# EAGLE design onepiece (EAGLE 5.07)
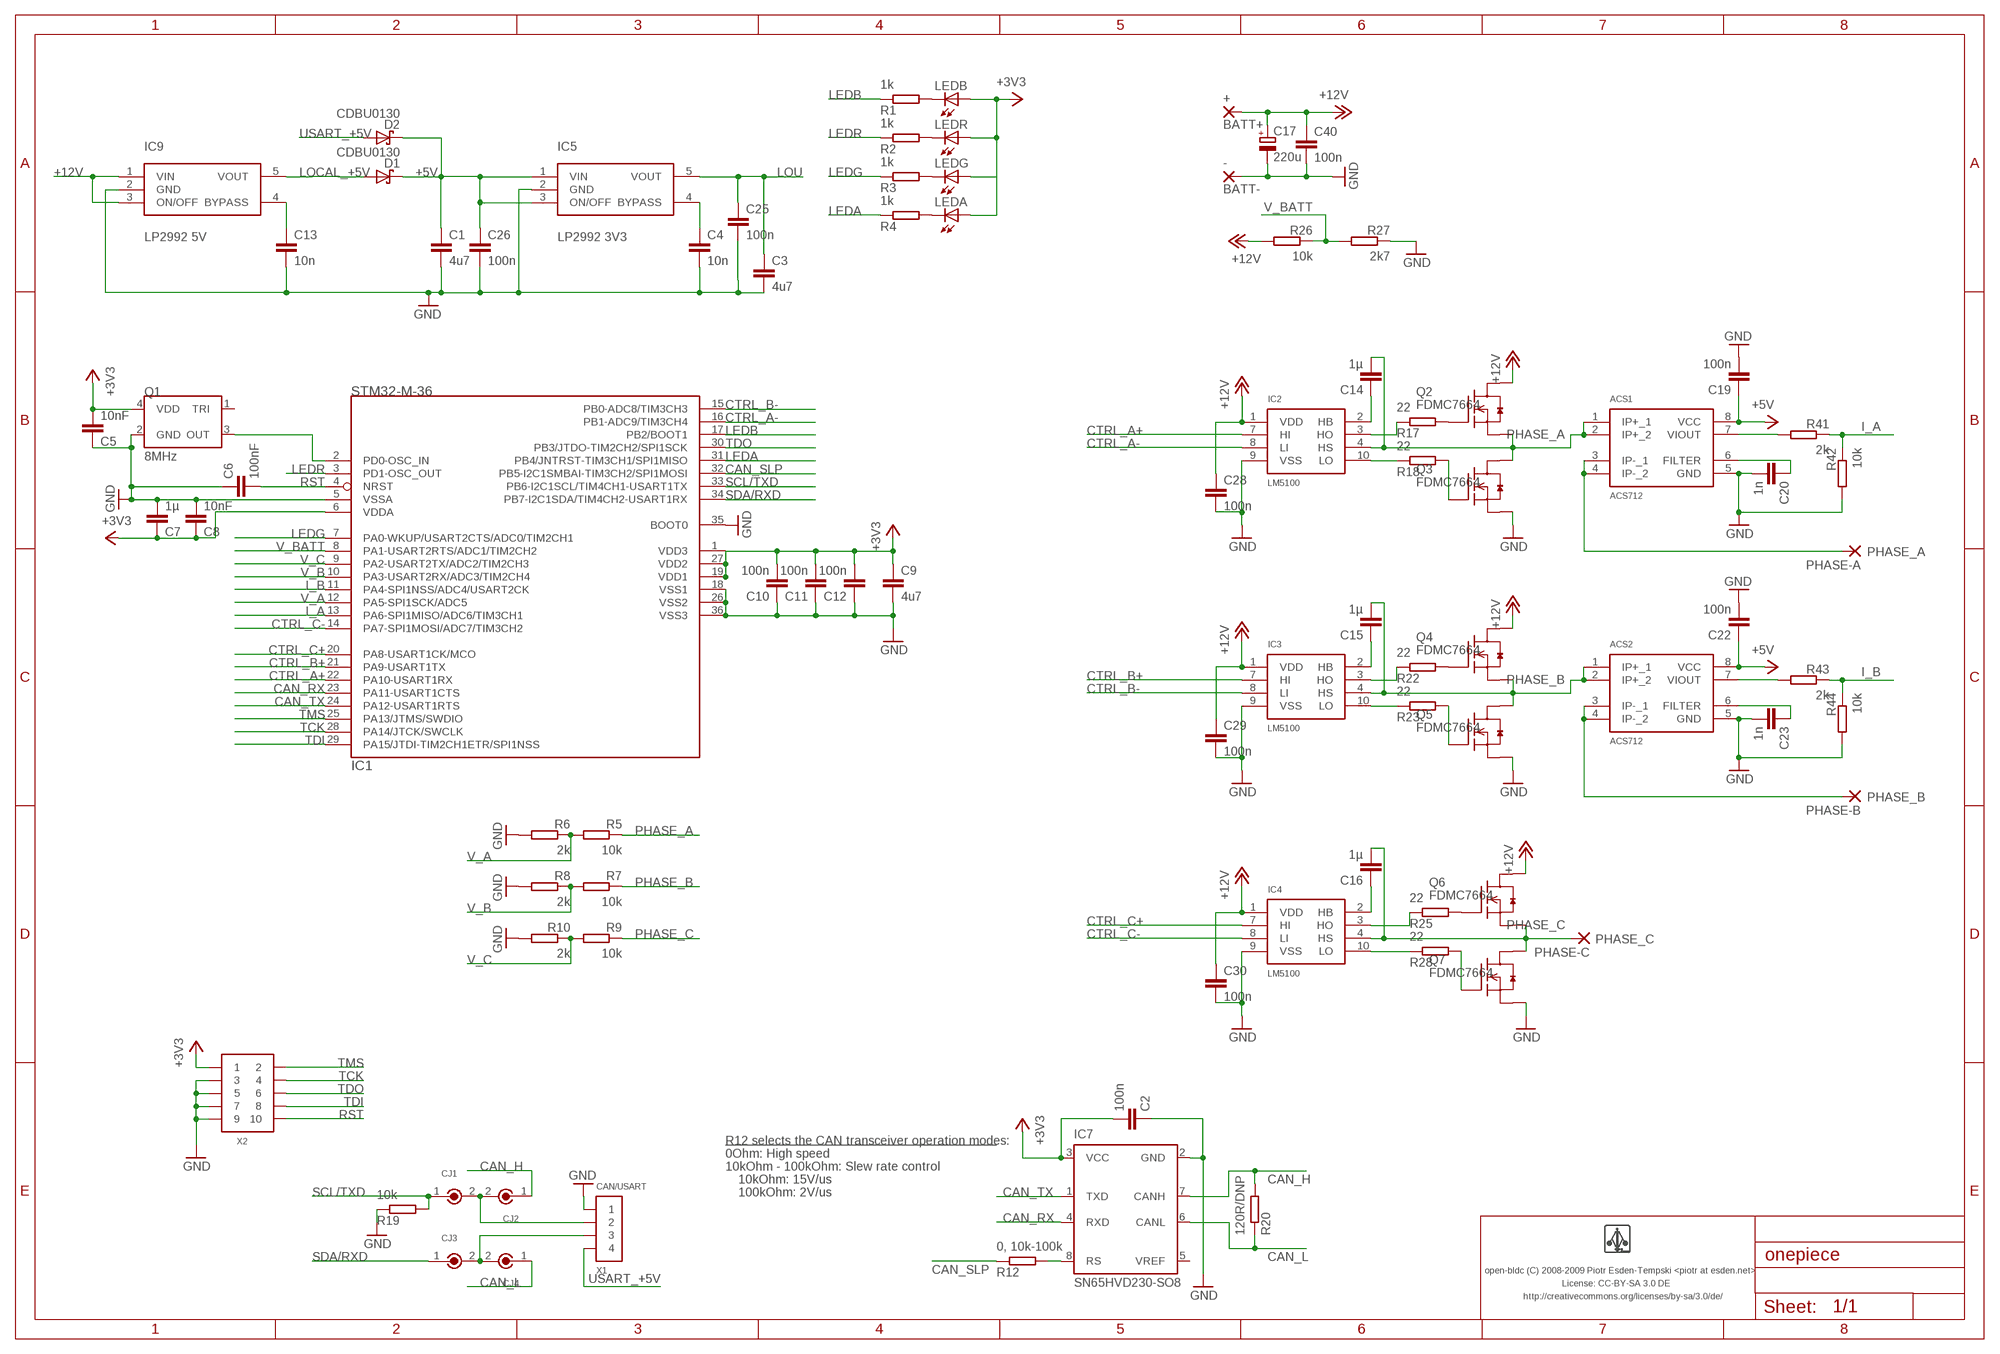
[diagram p0: schematic, sheet 1]

## Parts
+  BATT+  SMD5  [SMD2,54-5,08]
-  BATT-  SMD5  [SMD2,54-5,08]
ACS1  ACS712  [SO8]
ACS2  ACS712  [SO8]
C1  4u7  CAPACITOR-0603  [0603-CAP]
C2  100n  CAPACITOR-0603  [0603-CAP]
C3  4u7  CAPACITOR-0603  [0603-CAP]
C4  10n  CAPACITOR-0603  [0603-CAP]
C5  10nF  CAPACITOR-0603  [0603-CAP]
C6  100nF  CAPACITOR-0603  [0603-CAP]
C7  1µ  CAPACITOR-0603  [0603-CAP]
C8  10nF  CAPACITOR-0603  [0603-CAP]
C9  4u7  CAPACITOR-0603  [0603-CAP]
C10  100n  CAPACITOR-0603  [0603-CAP]
C11  100n  CAPACITOR-0603  [0603-CAP]
C12  100n  CAPACITOR-0603  [0603-CAP]
C13  10n  CAPACITOR-0603  [0603-CAP]
C14  1µ  CAPACITOR-0603  [0603-CAP]
C15  1µ  CAPACITOR-0603  [0603-CAP]
C16  1µ  CAPACITOR-0603  [0603-CAP]
C17  220u  CAPACITOR-POLD  [7343/D]
C19  100n  CAPACITOR-0603  [0603-CAP]
C20  1n  CAPACITOR-0603  [0603-CAP]
C22  100n  CAPACITOR-0603  [0603-CAP]
C23  1n  CAPACITOR-0603  [0603-CAP]
C25  100n  CAPACITOR-0603  [0603-CAP]
C26  100n  CAPACITOR-0603  [0603-CAP]
C28  100n  CAPACITOR-0603  [0603-CAP]
C29  100n  CAPACITOR-0603  [0603-CAP]
C30  100n  CAPACITOR-0603  [0603-CAP]
C40  100n  CAPACITOR-0603  [0603-CAP]
CJ1  CIRC_JMP  [CIRC_JMP]
CJ2  CIRC_JMP  [CIRC_JMP]
CJ3  CIRC_JMP  [CIRC_JMP]
CJ4  CIRC_JMP  [CIRC_JMP]
D1  CDBU0130  [0603-LED]
D2  CDBU0130  [0603-LED]
IC1  STM32-M-36  [VFQFPN36-LP]
IC2  LM5100  [LLP-10]
IC3  LM5100  [LLP-10]
IC4  LM5100  [LLP-10]
IC5  LP2992 3V3  LP2992  [SOT23-5]
IC7  SN65HVD230-SO8  SN65HVD230  [SO8]
IC9  LP2992 5V  LP2992  [SOT23-5]
LEDA  AMBER  LED  [0603-LED]
LEDB  BLUE  LED  [0603-LED]
LEDG  GREEN  LED  [0603-LED]
LEDR  RED  LED  [0603-LED]
PHASE-A  PHASE_A  SMD5  [SMD2,54-5,08]
PHASE-B  PHASE_B  SMD5  [SMD2,54-5,08]
PHASE-C  PHASE_C  SMD5  [SMD2,54-5,08]
Q1  8MHz  ASE_ASCILLATOR  [ASE_OSCILLATOR]
Q2  FDMC7664  [MLP33]
Q3  FDMC7664  [MLP33]
Q4  FDMC7664  [MLP33]
Q5  FDMC7664  [MLP33]
Q6  FDMC7664  [MLP33]
Q7  FDMC7664  [MLP33]
R1  1k  RESISTOR-0603  [0603-RES]
R2  1k  RESISTOR-0603  [0603-RES]
R3  1k  RESISTOR-0603  [0603-RES]
R4  1k  RESISTOR-0603  [0603-RES]
R5  10k  RESISTOR-0603  [0603-RES]
R6  2k  RESISTOR-0603  [0603-RES]
R7  10k  RESISTOR-0603  [0603-RES]
R8  2k  RESISTOR-0603  [0603-RES]
R9  10k  RESISTOR-0603  [0603-RES]
R10  2k  RESISTOR-0603  [0603-RES]
R12  0, 10k-100k  RESISTOR-0603  [0603-RES]
R17  22  RESISTOR-0603  [0603-RES]
R18  22  RESISTOR-0603  [0603-RES]
R19  10k  RESISTOR-0603  [0603-RES]
R20  120R/DNP  RESISTOR-0603  [0603-RES]
R22  22  RESISTOR-0603  [0603-RES]
R23  22  RESISTOR-0603  [0603-RES]
R25  22  RESISTOR-0603  [0603-RES]
R26  10k  RESISTOR-0603  [0603-RES]
R27  2k7  RESISTOR-0603  [0603-RES]
R28  22  RESISTOR-0603  [0603-RES]
R41  2k  RESISTOR-0603  [0603-RES]
R42  10k  RESISTOR-0603  [0603-RES]
R43  2k  RESISTOR-0603  [0603-RES]
R44  10k  RESISTOR-0603  [0603-RES]
U$1  LOGO  LOGO-SMALL  [LOGO_SMALL]
X1  CAN/USART  CONN_4-1-53261  [PB-53261-04]
X2  PIN_HDR_EDG_1.27MM_5-2  PIN_HDR_EDG_1.27MM_5-2-DH  [PIN_HDR_1.27MM_SMD_DH_10]

## Nets
+5V: ACS1.8(VCC) ACS2.8(VCC) C1.P$1 C19.P$1 C22.P$1 C26.P$1 D1.C D2.C IC5.1(VIN) IC5.3(ON/OFF)
+12V: +.1(P) C17.+ C28.P$1 C29.P$1 C30.P$1 C40.P$1 IC2.1(VDD) IC3.1(VDD) IC4.1(VDD) IC9.1(VIN) IC9.3(ON/OFF) Q2.5678D(D) Q4.5678D(D) Q6.5678D(D) R26.P$2
CAN_H: CJ2.1 IC7.7(CANH) R20.P$2
CAN_L: CJ4.1 IC7.6(CANL) R20.P$1
CAN_RX: IC1.23(PA11-USART1CTS) IC7.4(RXD)
CAN_SLP: IC1.32(PB5-I2C1SMBAI-TIM3CH2/SPI1MOSI) R12.P$1
CAN_TX: IC1.24(PA12-USART1RTS) IC7.1(TXD)
CTRL_A+: IC1.22(PA10-USART1RX) IC2.7(HI)
CTRL_A-: IC1.16(PB1-ADC9/TIM3CH4) IC2.8(LI)
CTRL_B+: IC1.21(PA9-USART1TX) IC3.7(HI)
CTRL_B-: IC1.15(PB0-ADC8/TIM3CH3) IC3.8(LI)
CTRL_C+: IC1.20(PA8-USART1CK/MCO) IC4.7(HI)
CTRL_C-: IC1.14(PA7-SPI1MOSI/ADC7/TIM3CH2) IC4.8(LI)
GND: -.1(P) ACS1.5(GND) ACS2.5(GND) C1.P$2 C2.P$1 C3.P$2 C4.P$2 C5.P$1 C6.P$1 C7.P$2 C8.P$2 C9.P$2 C10.P$1 C11.P$1 C12.P$1 C13.P$2 C17.- C19.P$2 C20.P$2 C22.P$2 C23.P$2 C25.P$2 C26.P$2 C28.P$2 C29.P$2 C30.P$2 C40.P$2 IC1.5(VSSA) IC1.18(VSS1) IC1.26(VSS2) IC1.35(BOOT0) IC1.36(VSS3) IC2.9(VSS) IC3.9(VSS) IC4.9(VSS) IC5.2(GND) IC7.2(GND) IC9.2(GND) Q1.2(GND) Q3.123S(S) Q5.123S(S) Q7.123S(S) R6.P$2 R8.P$2 R10.P$2 R19.P$1 R27.P$1 R42.P$2 R44.P$2 X1.1 X2.3 X2.5 X2.7 X2.9
I_A: IC1.13(PA6-SPI1MISO/ADC6/TIM3CH1) R41.P$1 R42.P$1
I_B: IC1.11(PA4-SPI1NSS/ADC4/USART2CK) R43.P$1 R44.P$1
I_PHASE_A: ACS1.3(IP-_1) ACS1.4(IP-_2) PHASE-A.1(P)
I_PHASE_B: ACS2.3(IP-_1) ACS2.4(IP-_2) PHASE-B.1(P)
LEDA: IC1.31(PB4/JNTRST-TIM3CH1/SPI1MISO) R4.P$1
LEDB: IC1.17(PB2/BOOT1) R1.P$1
LEDG: IC1.7(PA0-WKUP/USART2CTS/ADC0/TIM2CH1) R3.P$1
LEDR: IC1.3(PD1-OSC_OUT) R2.P$1
LOCAL_+5V: D1.A IC9.5(VOUT)
LOU: C2.P$2 C3.P$1 C5.P$2 C7.P$1 C8.P$1 C9.P$1 C10.P$2 C11.P$2 C12.P$2 C25.P$1 IC1.1(VDD3) IC1.6(VDDA) IC1.19(VDD1) IC1.27(VDD2) IC5.5(VOUT) IC7.3(VCC) LEDA.A LEDB.A LEDG.A LEDR.A Q1.4(VDD) X2.1 ; supply symbol labelled +3V3
N$1: IC3.3(HO) R22.P$1
N$2: IC2.3(HO) R17.P$1
N$3: LEDB.C R1.P$2
N$4: C4.P$1 IC5.4(BYPASS)
N$5: LEDG.C R3.P$2
N$6: C13.P$1 IC9.4(BYPASS)
N$7: IC2.10(LO) R18.P$1
N$8: IC7.8(RS) R12.P$2
N$9: CJ3.2 CJ4.2 X1.3
N$10: LEDR.C R2.P$2
N$11: Q2.4G(G) R17.P$2
N$12: C14.P$1 IC2.2(HB)
N$13: IC3.10(LO) R23.P$1
N$14: Q4.4G(G) R22.P$2
N$15: Q6.4G(G) R25.P$2
N$16: C15.P$1 IC3.2(HB)
N$17: Q5.4G(G) R23.P$2
N$18: IC4.3(HO) R25.P$1
N$19: IC4.10(LO) R28.P$1
N$21: C16.P$1 IC4.2(HB)
N$22: LEDA.C R4.P$2
N$23: CJ1.2 CJ2.2 X1.2
N$28: Q7.4G(G) R28.P$2
N$31: ACS1.6(FILTER) C20.P$1
N$32: ACS1.7(VIOUT) R41.P$2
N$34: ACS2.6(FILTER) C23.P$1
N$35: ACS2.7(VIOUT) R43.P$2
N$40: IC1.2(PD0-OSC_IN) Q1.3(OUT)
N$43: Q3.4G(G) R18.P$2
PHASE_A: ACS1.1(IP+_1) ACS1.2(IP+_2) C14.P$2 IC2.4(HS) Q2.123S(S) Q3.5678D(D) R5.P$1
PHASE_B: ACS2.1(IP+_1) ACS2.2(IP+_2) C15.P$2 IC3.4(HS) Q4.123S(S) Q5.5678D(D) R7.P$1
PHASE_C: C16.P$2 IC4.4(HS) PHASE-C.1(P) Q6.123S(S) Q7.5678D(D) R9.P$1
RST: C6.P$2 IC1.4(NRST) X2.10
SCL/TXD: CJ1.1 IC1.33(PB6-I2C1SCL/TIM4CH1-USART1TX) R19.P$2
SDA/RXD: CJ3.1 IC1.34(PB7-I2C1SDA/TIM4CH2-USART1RX)
TCK: IC1.28(PA14/JTCK/SWCLK) X2.4
TDI: IC1.29(PA15/JTDI-TIM2CH1ETR/SPI1NSS) X2.8
TDO: IC1.30(PB3/JTDO-TIM2CH2/SPI1SCK) X2.6
TMS: IC1.25(PA13/JTMS/SWDIO) X2.2
USART_+5V: D2.A X1.4
V_A: IC1.12(PA5-SPI1SCK/ADC5) R5.P$2 R6.P$1
V_B: IC1.10(PA3-USART2RX/ADC3/TIM2CH4) R7.P$2 R8.P$1
V_BATT: IC1.8(PA1-USART2RTS/ADC1/TIM2CH2) R26.P$1 R27.P$2
V_C: IC1.9(PA2-USART2TX/ADC2/TIM2CH3) R9.P$2 R10.P$1
Unconnected: IC7.5(VREF) Q1.1(TRI)

## Notes on the sheet
- R12 selects the CAN transceiver operation modes:
- 0Ohm: High speed
- 10kOhm - 100kOhm: Slew rate control
- 10kOhm: 15V/us
- 100kOhm: 2V/us
- open-bldc (C) 2008-2009 Piotr Esden-Tempski <piotr at esden.net>
- License: CC-BY-SA 3.0 DE
- http://creativecommons.org/licenses/by-sa/3.0/de/

## Library data of the parts
+ - PHASE-A PHASE-B PHASE-C = wirepad:SMD5: SMD PAD
ACS1 ACS2 = open-bldc:ACS712
C1-C16 C19 C20 C22 C23 C25 C26 C28-C30 C40 = pel_dipol_comp:CAPACITOR
C17 = res_cap:CAPACITOR-POL
CJ1-CJ4 = pel_jumpers:CIRC_JMP
D1 D2 = open-bldc:CDBU0130
IC1 = pel_stm32:STM32-M-36: STM32F103 Medium Density 36 Pins
IC2-IC4 = open-bldc:LM5100
IC5 IC9 = open-bldc:LP2992
IC7 = open-bldc:SN65HVD230: SN65HVD230 - 3.3V CAN Transceiver - 3.3V operation - ISO 11898 compliant - up to 1Mbps - up to 120 nodes - listen only mode - slope control
LEDA LEDB LEDG LEDR = open-bldc:LED
Q1 = open-bldc:ASE_ASCILLATOR
Q2-Q7 = open-bldc:FDMC7664
R1-R10 R12 R17-R20 R22 R23 R25-R28 R41-R44 = pel_dipol_comp:RESISTOR
U$1 = open-bldc:LOGO
X1 = pel_molex:CONN_4-1
X2 = open-bldc:PIN_HDR_EDG_1.27MM_5-2

## Board
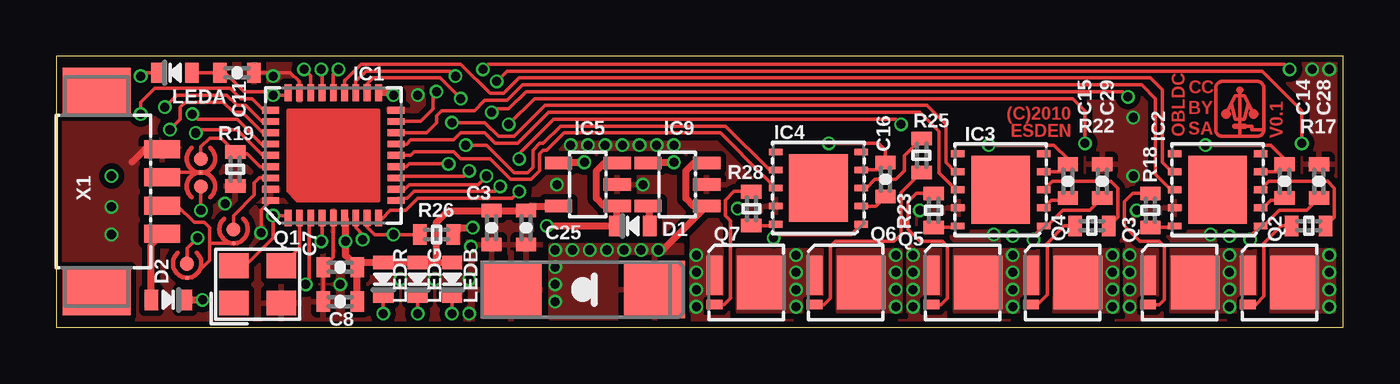
[diagram p1: board, top side]
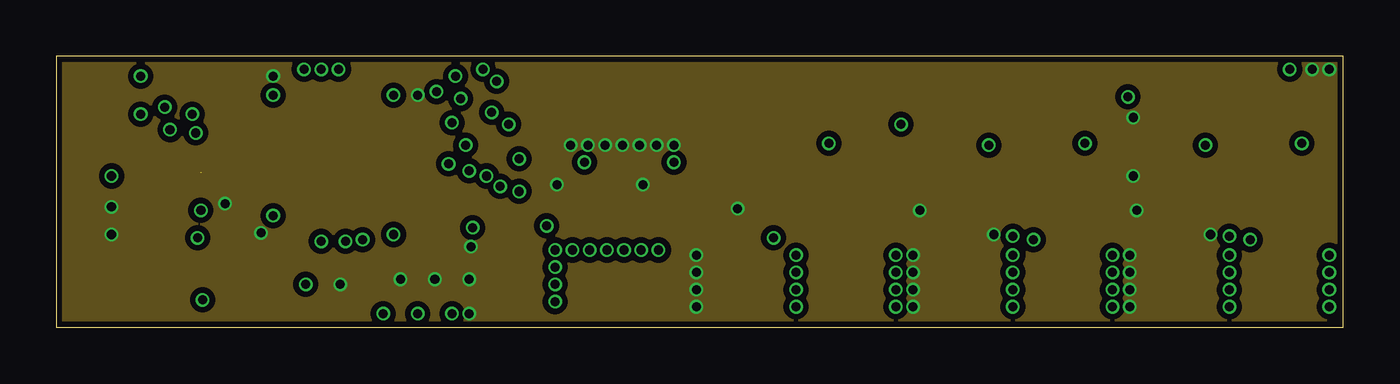
[diagram p2: board, inner layer Route2]
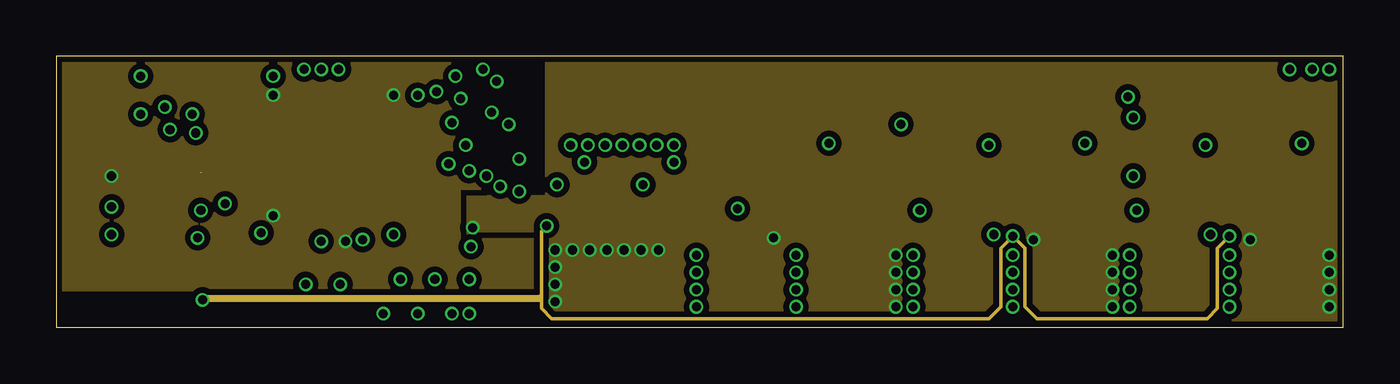
[diagram p3: board, inner layer Route15]
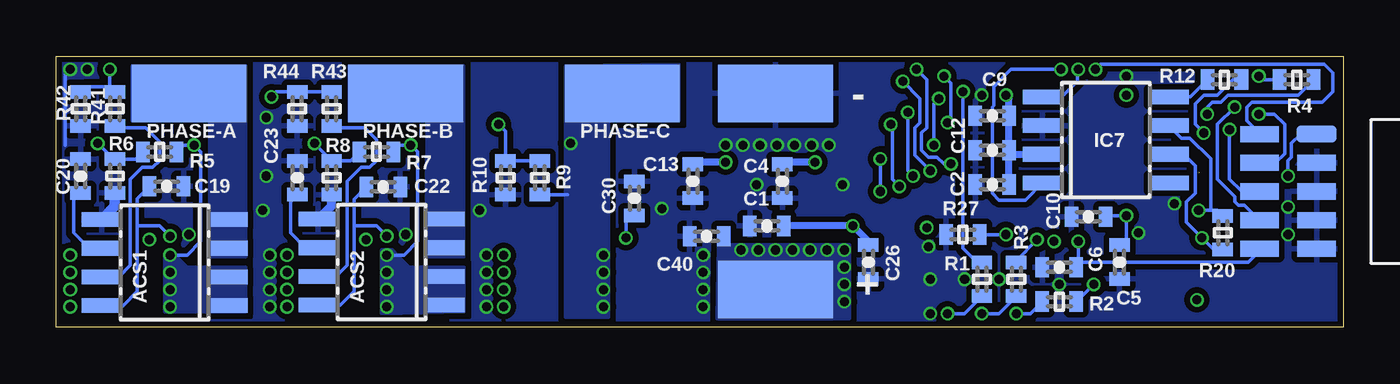
[diagram p4: board, bottom side, seen from below]

Size 57 x 12 mm. Coordinates in mm from the lower left corner, seen from the top.
Outline: 0,0 57,0 57,12 0,12 0,0
Copper layers (1*2+15*16): Top 0.035mm / dielectric 1.5mm / Route2 0.035mm / dielectric 0.15mm / Route15 0.035mm / dielectric 0.2mm / Bottom 0.035mm
Design rules "default *": minimum track width 6mil, minimum drill 0.4mm, track to track 6mil, track to pad 6mil, pad to pad 6mil, via to via 6mil, smd to smd 6mil, copper to edge 10mil, drill to drill 6mil, minimum pad ring 0.1mm, minimum via ring 0.1mm, stop-mask expansion 4mil, vias tented up to drill 0.4mm, thermal gap 10mil

### Footprints (pad centres in the part's own frame; a part is rotated, then mirrored left to right if it is on the bottom)
SMD2,54-5,08 = smd 2.54 x 5.08: 1 0,0
SO8 = smd 0.65 x 1.75: 1 -1.905,-2.8; 2 -0.635,-2.8; 3 0.635,-2.8; 4 1.905,-2.8; 5 1.905,2.8; 6 0.635,2.8; 7 -0.635,2.8; 8 -1.905,2.8
0603-CAP = smd 0.6 x 0.9: P$1 -0.75,0; P$2 0.75,0
7343/D = smd 2.7 x 2.55: + -3.175,0; - 3.175,0
CIRC_JMP = smd 0.61 x 0.61: 1 0,0 | smd 0.203 x 0.203: 2 0,0.617
0603-LED = smd 0.6 x 0.9: A 0.75,0; C -0.75,0
VFQFPN36-LP = smd 0.75 x 0.3: 1 -2.775,2; 2 -2.775,1.5; 3 -2.775,1; 4 -2.775,0.5; 5 -2.775,0; 6 -2.775,-0.5; 7 -2.775,-1; 8 -2.775,-1.5; 9 -2.775,-2; 19 2.775,-2; 20 2.775,-1.5; 21 2.775,-1; 22 2.775,-0.5; 23 2.775,0; 24 2.775,0.5; 25 2.775,1; 26 2.775,1.5; 27 2.775,2 | smd 0.3 x 0.75: 10 -2,-2.775; 11 -1.5,-2.775; 12 -1,-2.775; 13 -0.5,-2.775; 14 0,-2.775; 15 0.5,-2.775; 16 1,-2.775; 17 1.5,-2.775; 18 2,-2.775; 28 2,2.775; 29 1.5,2.775; 30 1,2.775; 31 0.5,2.775; 32 0,2.775; 33 -0.5,2.775; 34 -1,2.775; 35 -1.5,2.775; 36 -2,2.775
LLP-10 = smd 0.3 x 0.6: 1 1.6,1.9; 2 0.8,1.9; 3 0,1.9; 4 -0.8,1.9; 5 -1.6,1.9; 6 -1.6,-1.9; 7 -0.8,-1.9; 8 0,-1.9; 9 0.8,-1.9; 10 1.6,-1.9 | smd 3 x 2.6: PAD 0,0
SOT23-5 = smd 0.55 x 1.2: 1 -0.95,-1.3; 2 0,-1.3; 3 0.95,-1.3; 4 0.95,1.3; 5 -0.95,1.3
ASE_OSCILLATOR = smd 1.3 x 1.1: 1 -1.05,-0.825; 2 1.05,-0.825; 3 1.05,0.825; 4 -1.05,0.825
MLP33 = smd 0.42 x 0.7: 4G 0.975,-1.4 | smd 1.72 x 0.7: 123S -0.325,-1.4 | smd 2.37 x 2.15: 5678D 0,0.675
0603-RES = smd 0.6 x 0.9: P$1 -0.75,0; P$2 0.75,0
PB-53261-04 = smd 0.8 x 1.6: 1 -1.875,1.1; 2 -0.625,1.1; 3 0.625,1.1; 4 1.875,1.1 | smd 2.1 x 3: MNT1 -4.425,-1.8; MNT2 4.425,-1.8
PIN_HDR_1.27MM_SMD_DH_10 = smd 1.78 x 0.76: 1 -1.27,-2.54 | smd 1.702 x 0.711: 2 1.27,-2.54; 3 -1.27,-1.27; 4 1.27,-1.27; 5 -1.27,0; 6 1.27,0; 7 -1.27,1.27; 8 1.27,1.27; 9 -1.27,2.54; 10 1.27,2.54

### Placement (x,y rotation side)
+  25.15,1.68 270 bottom
-  25.15,10.36 270 bottom
ACS1  52.2,2.87 90 bottom
ACS2  42.6,2.9 90 bottom
C1  25.53,4.5 180 bottom
C2  15.54,6.32 0 bottom
C3  19.28,4.42 270 top
C4  24.84,6.48 270 bottom
C5  9.91,2.9 90 bottom
C6  12.57,2.67 0 bottom
C7  12.57,2.67 180 top
C8  12.57,1.14 180 top
C9  15.54,9.37 180 bottom
C10  11.28,4.9 0 bottom
C11  8,11.28 180 top
C12  15.54,7.85 0 bottom
C13  28.8,6.48 270 bottom
C14  54.41,6.48 90 top
C15  44.81,6.48 90 top
C16  36.73,6.55 90 top
C17  23.32,1.68 180 top
C19  52.12,6.25 0 bottom
C20  55.93,6.71 90 bottom
C22  42.52,6.22 0 bottom
C23  46.33,6.63 90 bottom
C25  20.8,4.42 270 top
C26  21.03,2.9 270 bottom
C28  55.93,6.48 90 top
C29  46.33,6.48 90 top
C30  31.39,5.71 90 bottom
C40  28.19,4.04 180 bottom
CJ1  6.4,7.47 180 top
CJ2  6.4,6.25 0 top
CJ3  7.85,4.34 180 top
CJ4  5.79,2.82 180 top
D1  25.53,4.5 0 top
D2  4.95,1.22 180 top
IC1  12.27,7.62 90 top
IC2  51.44,6.1 270 top
IC3  41.83,6.1 270 top
IC4  33.76,6.17 270 top
IC5  23.55,6.32 90 top
IC7  10.52,8.31 270 bottom
IC9  27.51,6.32 90 top
LEDA  5.26,11.28 0 top
LEDB  17.53,2.13 90 top
LEDG  16,2.13 90 top
LEDR  14.48,2.13 90 top
PHASE-A  51.13,10.36 90 bottom
PHASE-B  41.53,10.36 90 bottom
PHASE-C  31.93,10.36 90 bottom
Q1  8.92,1.91 0 top
Q2  54.18,1.98 270 top
Q3  49.76,1.98 270 top
Q4  44.58,1.98 270 top
Q5  40.16,1.98 270 top
Q6  34.98,1.98 270 top
Q7  30.56,1.98 270 top
R1  16,2.13 270 bottom
R2  12.57,1.14 180 bottom
R3  14.48,2.13 270 bottom
R4  2.06,10.97 180 bottom
R5  52.43,7.77 180 bottom
R6  54.41,6.7 270 bottom
R7  42.82,7.77 180 bottom
R8  44.81,6.63 270 bottom
R9  35.59,6.63 90 bottom
R10  37.11,6.63 270 bottom
R12  5.26,10.97 180 bottom
R17  55.47,4.5 180 top
R18  48.46,5.18 90 top
R19  7.92,7.01 90 top
R20  5.33,4.19 90 bottom
R22  45.87,4.5 180 top
R23  38.86,5.18 90 top
R25  38.33,7.62 270 top
R26  16.84,4.11 0 top
R27  16.84,4.11 0 bottom
R28  30.78,5.26 90 top
R41  54.41,9.68 270 bottom
R42  55.93,9.68 270 bottom
R43  44.81,9.68 270 bottom
R44  46.33,9.68 270 bottom
U$1  52.43,9.83 0 top
X1  3.58,6.02 270 top
X2  2.44,6.02 180 bottom

### Tracks (layer width: path | path; a pad name or v marks a point on that pad's centre or on a via)
+5V  (via drill 0.4)
  Top 0.305: IC5.3 24.27,7.28 23.93,6.93 23.93,5.71 24.27,5.38 IC5.1 24.85,4.57 C1.P$1 v21.72,4.5 | D2.C v6.48,1.22
  Route15 0.152: v51.97,4.04 51.44,3.5 51.44,0.84 50.98,0.38 43.43,0.38 42.9,0.91 42.9,3.5 v42.37,4.04 41.83,3.5 41.83,0.91 41.3,0.38 21.95,0.38 21.49,0.84 | 21.49,1.29 21.49,0.84 | 21.41,1.29 21.49,1.29 | 21.49,1.29 21.49,0.84 | 21.49,1.29 21.49,4.27 v21.72,4.5
  Route15 0.305: v6.48,1.22 6.55,1.29 21.41,1.29
  Bottom 0.152: C19.P$1 53.42,5.7 53.42,4.5 | 53.42,4.5 53.42,1.6 54.05,0.96 ACS1.8 | v51.97,4.04 52.43,4.5 53.42,4.5 | ACS2.8 44.42,0.99 43.81,1.6 43.81,4.5 | 43.81,4.5 43.81,5.68 C22.P$1 | v42.37,4.04 42.82,4.5 43.81,4.5
  Bottom 0.305: C1.P$1 v21.72,4.5 21.03,3.81 C26.P$1
+12V  (via drill 0.4)
  Top 0.152: C28.P$1 55.38,5.18 54.18,5.18 53.49,4.5 IC2.1 52.88,4.04 v52.88,3.89 | C29.P$1 45.78,5.18 44.58,5.18 43.89,4.5 IC3.1 43.28,4.04 v43.28,3.89 | IC4.1 35.2,4.12 32.54,4.12 31.93,4.12 v31.77,3.96
  Top 0.305: v26.67,3.43 26.86,3.43 IC9.1 28.23,5.38 27.89,5.71 27.89,6.93 28.23,7.28 IC9.3 | R26.P$2 17.89,4.42 v18.44,4.42
  Bottom 0.152: C30.P$1 31.77,4.96 v31.77,3.96
  other vias: 37.19,0.91 37.19,1.68 37.19,2.44 37.19,3.2 46.79,0.91 46.79,1.68 46.79,2.44 46.79,3.2 56.39,0.91 56.39,1.68 56.39,2.44 56.39,3.2 25.91,3.43 25.15,3.43 24.38,3.43 23.62,3.43 22.86,3.43 22.1,3.43 22.1,2.67 22.1,1.91 22.1,1.14
  pour Top (no thermals): 37.41,0.69 34.59,0.69 34.59,3.43 37.41,3.43
  pour Top (no thermals): 47.02,0.69 44.2,0.69 44.2,3.43 47.02,3.43
  pour Top (no thermals): 56.62,0.69 53.8,0.69 53.8,3.43 56.62,3.43
  pour Route15 (isolate 0.254, rank 6): 21.79,0 57.15,0 57.15,11.99 21.72,11.99 21.72,5.79 18.21,5.79 18.21,4.11 21.79,4.11
  pour Bottom (no thermals): 27.74,0.38 27.66,3.66 21.87,3.66 21.87,0.38
  pour Top: 27.81,0.38 27.74,3.66 21.87,3.66 21.87,0.38
CAN_H  (via drill 0.4)
  Top 0.152: v6.4,5.18 CJ2.1
  Bottom 0.152: IC7.7 7.16,8.38 6.78,8.38 5.87,7.47 5.87,5.18 | 5.88,5.18 5.87,5.18 | 5.88,5.18 5.87,5.18 | 5.88,5.18 v6.4,5.18 | 5.88,5.18 5.58,5.18 R20.P$2
CAN_L  (via drill 0.4)
  Top 0.152: CJ4.1 5.79,3.5 v6.25,3.96
  Bottom 0.152: IC7.6 7.06,7.67 6.55,7.16 6.55,5.94 6.93,5.56 6.93,4.65 v6.25,3.96 5.73,3.44 R20.P$1
CAN_RX  (via drill 0.4)
  Top 0.152: IC1.23 12.27,11.2 v12.5,11.43
  Bottom 0.152: IC7.4 14.08,5.64 15.24,5.64 15.54,5.94 15.54,9.75 15.47,9.83 15.47,10.67 14.71,11.43 v12.5,11.43
CAN_SLP  (via drill 0.4)
  Top 0.152: IC1.32 9.14,7.62 8,8.76 6.33,8.76 v6.17,8.61
  Bottom 0.152: 4.66,10.97 R12.P$1 4.88,10.97 5.56,10.29 6.17,10.29 6.55,9.91 6.55,8.99 v6.17,8.61
CAN_TX  (via drill 0.4)
  Top 0.152: IC1.24 11.77,11.4 v11.73,11.43
  Bottom 0.152: IC7.1 12.45,10.21 11.77,10.9 11.77,11.4 v11.73,11.43
CTRL_A+
  Top 0.152: IC2.7 49.42,6.9 49,7.32 49,10.52 48.46,11.05 20.5,11.05 19.81,10.36 19.2,10.36 17.91,11.66 17.75,11.66 13.49,11.66 12.8,10.97 12.77,10.94 IC1.22
CTRL_A-
  Top 0.152: IC2.8 49.38,6.1 48.69,6.78 48.69,10.13 48.08,10.74 20.65,10.74 19.96,10.06 18.97,10.06 18.52,9.6 17.07,9.6 16.84,9.37 16.84,9.07 16.39,8.62 IC1.16
CTRL_B+  (via drill 0.4)
  Top 0.152: IC3.7 39.81,6.9 39.4,7.32 39.4,8.99 38.56,9.83 21.64,9.83 20.27,8.46 19.58,8.46 18.97,9.07 v17.53,9.07 | v17.68,11.12 17.45,11.35 13.72,11.35 13.26,10.9 13.26,10.4 IC1.21
  Bottom 0.152: v17.68,11.12 17.37,10.82 17.37,9.22 v17.53,9.07
CTRL_B-
  Top 0.152: IC3.8 39.85,6.1 39.09,6.86 39.09,8.69 38.25,9.53 21.79,9.53 20.42,8.15 19.43,8.15 18.97,8.61 17.91,8.61 17.6,8.31 15.7,8.31 15.51,8.12 IC1.15
CTRL_C+  (via drill 0.4)
  Top 0.152: v17.91,10.13 17.68,10.36 16.99,11.05 14.02,11.05 13.77,10.8 IC1.20 | v18.14,8.08 19.05,8.08 20.27,6.86 20.88,6.86 21.11,7.09 21.11,7.85 21.41,8.15 21.57,8.15 22.33,8.91 29.64,8.91 31.59,6.97 IC4.7
  Bottom 0.152: v17.91,10.13 18.14,9.91 v18.14,8.08
CTRL_C-
  Top 0.152: 31.77,6.17 IC4.8 31.32,6.71 29.41,8.61 22.48,8.61 21.72,7.85 21.57,7.85 21.41,7.7 21.41,6.93 21.03,6.55 20.12,6.55 19.2,7.47 17.91,7.47 17.6,7.77 15.85,7.77 15.7,7.62 IC1.14
GND  (via drill 0.4)
  Top 0.152: C28.P$2 56.15,7.23 | C8.P$2 C7.P$2 12.27,3.11 IC1.5 | C11.P$1 10.36,11.28 10.74,10.9 10.74,10.42 IC1.26 | IC1.36 9.07,5.2 v9.07,4.19
  Top 0.305: 3.35,7.32 3.93,7.89
  Bottom 0.152: C20.P$2 55.99,7.46 | 56.62,8.08 56.62,11.2
  Bottom 0.406: R8.P$2 44.81,5.39 ACS2.5
  Bottom 0.457: R6.P$2 54.41,5.36 ACS1.5
  other vias: 28.35,0.91 28.35,1.68 28.35,2.44 28.35,3.2 37.95,0.91 37.95,1.68 37.95,2.44 37.95,3.2 47.55,0.91 47.55,1.68 47.55,2.44 47.55,3.2 55.63,11.43 56.39,11.43 51.13,4.11 47.85,5.18 38.25,5.18 41.53,4.11 47.7,9.3 47.7,6.71 30.18,5.26 16,10.29 12.57,1.91 22.78,8.08 23.55,8.08 24.31,8.08 25.07,8.08 25.83,8.08 26.59,8.08 27.36,8.08 25.98,6.32 22.17,6.32 2.44,5.33 2.44,4.11 9.6,11.13 7.47,5.49 18.29,0.61 18.29,2.13 18.36,3.58 16.76,2.13 15.24,2.13
  pour Top (no thermals): 28.12,3.43 29.49,3.43 29.49,0.69 28.12,0.69
  pour Top (no thermals): 37.72,0.69 39.24,0.69 39.24,3.43 37.72,3.43
  pour Top (no thermals): 47.35,0.69 48.77,0.69 48.77,3.43 47.32,3.43
  pour Bottom (isolate 0.254, rank 6): 0,0 57.15,0 57.15,11.99 0,11.99
  pour Route2 (isolate 0.254, rank 6): 0,0 57.15,0 57.15,11.99 0,11.99
  pour Top (isolate 0.254, rank 6): 0,0 57.15,0 57.15,11.99 0,11.99
  pour Bottom (no thermals): 28.65,3.51 28.12,3.51 28.12,0.23 28.65,0.23
I_A  (via drill 0.4)
  Top 0.152: v54.63,11.43 54.41,11.66 19.13,11.66 v18.9,11.43 | v17.37,7.24 15.62,7.24 15.54,7.16 15.5,7.12 IC1.13
  Bottom 0.152: R42.P$1 55.69,10.67 55.24,10.67 54.65,10.67 R41.P$1 54.63,10.66 v54.63,11.43 | v17.37,7.24 17.68,7.24 17.98,7.54 18.36,7.54 18.67,7.85 18.67,8.61 18.44,8.84 18.44,10.97 v18.9,11.43
I_B  (via drill 0.4)
  Top 0.152: v47.47,10.21 47.24,10.44 20.8,10.44 20.04,9.68 19.43,9.68 v19.28,9.53 | v19.05,6.71 18.67,6.33 15.62,6.33 15.42,6.12 IC1.11
  Bottom 0.152: R43.P$1 R44.P$1 47.26,10.43 v47.47,10.21 | v19.28,9.53 19.28,6.93 v19.05,6.71
I_PHASE_A
  pour Bottom (no thermals): 48.62,3.12 50.22,3.12 50.22,9.14 53.64,9.14 53.64,11.58 48.62,11.58
I_PHASE_B
  pour Bottom (no thermals): 38.96,3.1 40.61,3.12 40.59,9.14 44.04,9.14 44.04,11.58 38.96,11.58
LEDA  (via drill 0.4)
  Top 0.152: IC1.31 9.1,8.12 8,9.22 6.25,9.22 v6.02,9.45
  Bottom 0.152: R4.P$1 1.99,10.29 5.03,10.29 | 5.03,10.29 5.11,10.29 | 5.03,10.29 5.11,10.29 | 5.03,10.29 5.11,10.29 | 5.11,10.29 5.41,9.98 5.79,9.98 6.02,9.75 v6.02,9.45
LEDB  (via drill 0.4)
  Top 0.152: v16.84,10.44 16.69,10.29 16.69,9.68 16.13,9.12 IC1.17
  Bottom 0.152: v16.84,10.44 16.84,10.13 16.84,6.78 16.84,6.71 16.84,3.5 16.22,2.88 R1.P$1
LEDG  (via drill 0.4)
  Top 0.152: IC1.7 13.27,4.41 13.56,4.12 v13.56,3.89
  Bottom 0.152: v13.56,3.89 13.56,3.87 14.48,2.96 R3.P$1
LEDR  (via drill 0.4)
  Top 0.152: v11.05,1.91 11.2,2.06 11.2,4.78 IC1.3
  Bottom 0.152: v11.05,1.91 v11.05,1.92 R2.P$1
LOCAL_+5V
  Top 0.305: IC9.5 26.28,5.31 D1.A
LOU  (via drill 0.4)
  Top 0.152: IC1.27 10.16,10.29 v9.6,10.29 9.45,10.44 8.31,10.44 7.47,11.28 C11.P$2 LEDA.A | IC1.1 10.16,4.95 v9.6,4.95 9.6,3.96 8.37,2.73 Q1.4 | 12.8,4.81 IC1.6
  Top 0.305: v14.94,10.29 14.83,10.39 IC1.19 | C8.P$1 C7.P$1 | 12.8,4.81 v12.8,3.81 12.8,3.19 C7.P$1 | 16.84,2.88 LEDG.A LEDR.A 13.54,2.88 C7.P$1 | 16.84,2.88 LEDB.A | 16.84,2.88 16.84,4.65 17.36,5.17 C3.P$1 C25.P$1 21.01,5.38 IC5.5
  Bottom 0.152: C10.P$2 10.48,4.95 v9.6,4.95 9.6,3.95 C5.P$2 | X2.1 1.88,8.56 2.29,8.15 2.29,7.54 2.44,7.39 v2.44,6.71
  Bottom 0.305: C12.P$2 C9.P$1 14.79,10.15 v14.94,10.29 | C2.P$2 C12.P$2 | IC7.3 14.62,7.67 C12.P$2
  pour Route15 (isolate 0.254, rank 5, no thermals): 0,12.04 21.34,12.04 21.34,6.17 17.83,6.17 17.83,3.89 21.18,3.89 21.18,1.68 0,1.68
N$1
  Top 0.152: R22.P$1 47.02,4.89 47.02,6.17 46.71,6.48 44.12,6.48 IC3.3
N$2
  Top 0.152: R17.P$1 56.24,4.5 56.62,4.88 56.62,6.17 56.31,6.48 53.72,6.48 IC2.3
N$3  (via drill 0.4)
  Top 0.152: v17.53,0.61 LEDB.C
  Bottom 0.152: v17.53,0.61 16.78,0.61 R1.P$2
N$4  (via drill 0.4)
  Top 0.305: IC5.4 22.29,7.32 v23.39,7.32
  Bottom 0.305: v23.39,7.32 24.75,7.32 C4.P$1
N$5  (via drill 0.4)
  Top 0.152: v16,0.61 LEDG.C
  Bottom 0.152: R3.P$2 15.24,0.61 v16,0.61
N$6  (via drill 0.4)
  Top 0.305: IC9.4 26.25,7.32 v27.36,7.32
  Bottom 0.305: C13.P$1 28.71,7.32 v27.36,7.32
N$7
  Top 0.152: IC2.10 49.47,4.43 R18.P$1
N$8
  Bottom 0.152: R12.P$2 6.77,10.21 IC7.8
N$9
  Top 0.152: CJ4.2 6.01,2.2 6.78,2.97 6.78,3.66 | 6.78,3.66 6.78,4.42 6.55,4.65 6.1,4.65 5.35,5.39 X1.3 | CJ3.2 6.86,3.73 6.78,3.66
N$10  (via drill 0.4)
  Top 0.152: LEDR.C v14.48,0.61
  Bottom 0.152: v14.48,0.61 13.86,0.61 R2.P$2
N$11
  Top 0.152: 52.82,0.97 Q2.4G 53.13,1.01 53.49,1.37 53.49,3.72 54.27,4.5 R17.P$2
N$12
  Top 0.152: C14.P$1 54.32,5.64 53.8,5.64 53.45,5.3 IC2.2
N$13
  Top 0.152: R23.P$1 39.87,4.43 IC3.10
N$14
  Top 0.152: Q4.4G 43.45,1.01 43.89,1.45 43.89,3.73 44.65,4.5 R22.P$2
N$15
  Top 0.152: Q6.4G 34,1.01 34.29,1.29 34.29,3.58 34.52,3.81 37.11,3.81 37.41,4.12 37.41,5.96 R25.P$2
N$16
  Top 0.152: IC3.2 44.08,5.64 44.12,5.64 44.72,5.64 C15.P$1
N$17
  Top 0.152: Q5.4G 39.18,1.01 39.47,1.29 39.47,3.58 39.24,3.81 38.25,3.81 37.72,4.34 37.72,5.56 38.09,5.93 R23.P$2
N$18
  Top 0.152: R25.P$1 37.57,7.61 37.57,6.93 37.19,6.55 36.27,6.55 35.89,6.17 IC4.3
N$19
  Top 0.152: R28.P$1 31.79,4.51 IC4.10
N$21
  Top 0.152: C16.P$1 36.3,5.37 IC4.2
N$22  (via drill 0.4)
  Top 0.152: v3.73,11.12 3.89,11.28 LEDA.C
  Bottom 0.152: v3.73,11.12 3.58,10.97 R4.P$2
N$23  (1 unrouted)
  Top 0.152: CJ2.2 4.9,6.87 X1.2
N$28
  Top 0.152: Q7.4G 29.58,1.01 29.87,1.29 29.87,3.5 29.87,4.72 29.64,4.95 29.64,5.64 30.02,6.02 R28.P$2
N$31
  Bottom 0.152: ACS1.6 55.55,3.5 56.24,4.19 56.24,5.65 C20.P$1
N$32
  Bottom 0.152: ACS1.7 54.23,2.23 53.72,2.74 53.72,6.56 53.19,7.09 52.73,7.09 52.43,7.39 52.43,8.23 53.04,8.84 54.32,8.84 R41.P$2
N$34
  Bottom 0.152: ACS2.6 45.97,3.53 46.63,4.19 46.63,5.58 C23.P$1
N$35
  Bottom 0.152: ACS2.7 44.6,2.26 44.12,2.74 44.12,6.48 43.51,7.09 43.13,7.09 42.82,7.39 42.82,8.31 43.36,8.84 44.72,8.84 R43.P$2
N$40
  Top 0.152: Q1.3 10.77,3.53 IC1.2
N$43
  Top 0.152: Q3.4G 48.86,1.01 49.07,1.22 49.07,3.59 48.86,3.81 48.01,3.81 47.32,4.5 47.32,5.56 47.69,5.93 R18.P$2
PHASE_A  (via drill 0.4)
  Top 0.152: IC2.4 54.08,6.9 C14.P$2 | v50.9,8.08 53.8,8.08 54.41,7.47 C14.P$2 | C14.P$2
  Bottom 0.152: 51.51,3.2 v51.97,3.2 51.21,3.2 50.6,3.81 50.6,7.78 v50.9,8.08 51.37,8.08 R5.P$1
  other vias: 51.97,1.68 51.97,2.44 51.97,0.91
  pour Top (no thermals): 49.38,0.69 53.11,0.69 53.11,3.43 49.38,3.43
  pour Bottom (no thermals): 48.62,0.69 52.2,0.69 52.2,3.2 arc90 51.97,3.43 arc90 51.74,3.2 51.21,2.67 48.62,2.67
PHASE_B  (via drill 0.4)
  Top 0.152: v41.3,8.08 44.2,8.08 44.81,7.47 C15.P$2 44.48,6.9 IC3.4
  Bottom 0.152: v42.37,3.2 41.6,3.2 41,3.81 41,7.77 v41.3,8.08 41.77,8.08 R7.P$1
  other vias: 42.37,0.91 42.37,1.68 42.37,2.44
  pour Top (no thermals): 39.78,0.69 43.51,0.69 43.51,3.43 39.78,3.43
  pour Bottom (no thermals): 38.94,0.69 42.6,0.61 42.6,3.43 42.14,3.43 41.38,2.67 38.94,2.67
PHASE_C  (via drill 0.4)
  Top 0.152: v34.21,8.15 36.42,8.15 36.73,7.85 C16.P$2 36.4,6.97 IC4.4
  Bottom 0.152: R9.P$1 34.38,5.88 34.37,5.87
  other vias: 32.77,3.2 32.77,2.44 32.77,1.68 32.77,0.91
  pour Top (no thermals): 30.18,0.69 33.91,0.69 33.91,3.43 30.18,3.43
  pour Bottom (no thermals): 29.41,9.14 32.54,9.14 32.54,0.46 34.44,0.46 34.44,11.58 29.41,11.66
RST  (via drill 0.4)
  Top 0.152: IC1.4 11.77,3.84 v11.73,3.81
  Bottom 0.152: 11.73,2.75 v11.73,3.81 | 11.73,2.75 C6.P$2 11.73,2.75 | 11.73,2.75 11.59,2.9 10.9,2.9 4.19,2.9 3.71,3.38 X2.10
SCL/TXD
  Top 0.152: IC1.33 9.03,7.12 8.46,7.7 7.99,7.7 R19.P$2 7.3,8.38 6.78,8.38 6.4,8 CJ1.1
SDA/RXD
  Top 0.152: IC1.34 8.98,6.62 8.76,6.4 8.76,5.87 7.85,4.95 CJ3.1
TCK  (via drill 0.4)
  Top 0.152: v3.73,9.45 3.73,9.98 4.34,10.59 7.7,10.59 8.15,10.13 8.67,10.13 9.19,9.62 IC1.28
  Bottom 0.152: v3.73,9.45 3.05,9.45 2.59,8.99 2.59,7.7 3,7.29 X2.4
TDI  (via drill 0.4)
  Top 0.152: IC1.29 9.09,9.12 8.38,9.83 8,9.83 7.54,10.29 5.33,10.29 v4.8,9.75
  Bottom 0.152: v4.8,9.75 5.56,8.99 5.56,6.55 5.18,6.17 4.8,5.79 4.8,5.56 4.65,5.41 4.37,5.41 X2.8
TDO  (via drill 0.4)
  Top 0.152: IC1.30 9.13,8.62 8.23,9.53 7.85,9.53 7.39,9.98 5.71,9.98 5.49,9.75 5.49,9.22 v5.03,8.76
  Bottom 0.152: v5.03,8.76 5.03,6.55 4.5,6.02 X2.6
TMS  (via drill 0.4)
  Top 0.152: IC1.25 11.27,11.13 v10.97,11.43
  Bottom 0.152: v10.97,11.43 10.74,11.66 0.84,11.66 0.46,11.28 0.46,10.44 0.91,9.98 4.04,9.98 4.27,9.75 4.27,9.14 3.71,8.59 X2.2
USART_+5V
  Top 0.305: X1.4 4.2,3.67 D2.A
V_A  (via drill 0.4)
  Top 0.152: v55.17,8.15 55.17,9.6 53.42,11.35 19.96,11.35 v19.51,10.9 | v18.29,6.93 18.06,6.71 15.13,6.71 IC1.12
  Bottom 0.152: R5.P$2 53.49,7.45 R6.P$1 54.47,7.45 v55.17,8.15 | v18.29,6.93 18.97,7.62 18.97,8.84 18.75,9.07 18.75,10.13 v19.51,10.9
V_B  (via drill 0.4)
  Top 0.152: v45.57,8.15 45.57,9.6 45.03,10.13 21.18,10.13 v20.04,8.99 | IC1.10 15.14,5.71 15.54,5.71 15.85,6.02 19.43,6.02 v19.66,6.25
  Bottom 0.152: R7.P$2 43.97,7.38 R8.P$1 v45.57,8.14 v45.57,8.15 | v19.66,6.25 19.96,6.55 19.96,8.91 v20.04,8.99
V_BATT  (via drill 0.4)
  Top 0.152: IC1.8 13.77,4.44 14.1,4.12 v14.94,4.12 R26.P$1
  Bottom 0.152: v14.94,4.12 R26.P$1
V_C  (via drill 0.4)
  Top 0.152: v37.41,8.99 37.19,9.22 22.02,9.22 20.5,7.7 v20.5,7.47 | v20.5,6.02 20.19,5.71 16,5.71 15.47,5.18 14.78,5.18 14.45,4.84 IC1.9
  Bottom 0.152: R9.P$2 R10.P$1 37.11,8.69 v37.41,8.99 | v20.5,7.47 20.5,7.24 v20.5,6.02

### Text on the board
Top: (C)2010 | CC | ESDEN | BY | SA | OBLDC | V0.1